# Altium project MCU009A.PrjPcb (part 2 of 4)

## Sheet MCU009A_Power+Misc.SchDoc: Power+Misc
size 431 x 279 mm; Date: Not shown in title block; ApprovedBy: Not shown in title block; CheckedBy: Not shown in title block; Author: Not shown in title block; CompanyName: Not shown in title block; Engineer: Not shown in title block; Organization: Not shown in title block; Address1: Not shown in title block; Address2: Not shown in title block; Address3: Not shown in title block; Address4: Not shown in title block; DocumentNumber: 3; Revision: Use project parameter SCH_Rev; SheetNumber: 3; SheetTotal: 7; PageSetup: Record=PageOptions|CenterHorizontal=True|CenterVertical=True|PrintScale=0.64|XCorrection=1.00|YCorrection=1.00|PrintKind=0|BorderSize=5000000|LeftOffset=0|BottomOffset=0|Orientation=2|PaperLength=1000|PaperWidth=1000|Scale=100|PaperSource=15|PrintQuality=600|MediaType=1|DitherType=10|PrintScaleMode=1|PaperKind=Letter; CurrentTime: Not shown in title block; CurrentDate: Not shown in title block; Time: Not shown in title block; DocumentFullPathAndName: Not shown in title block; DocumentName: Not shown in title block; ModifiedDate: Not shown in title block; ImagePath: Not shown in title block
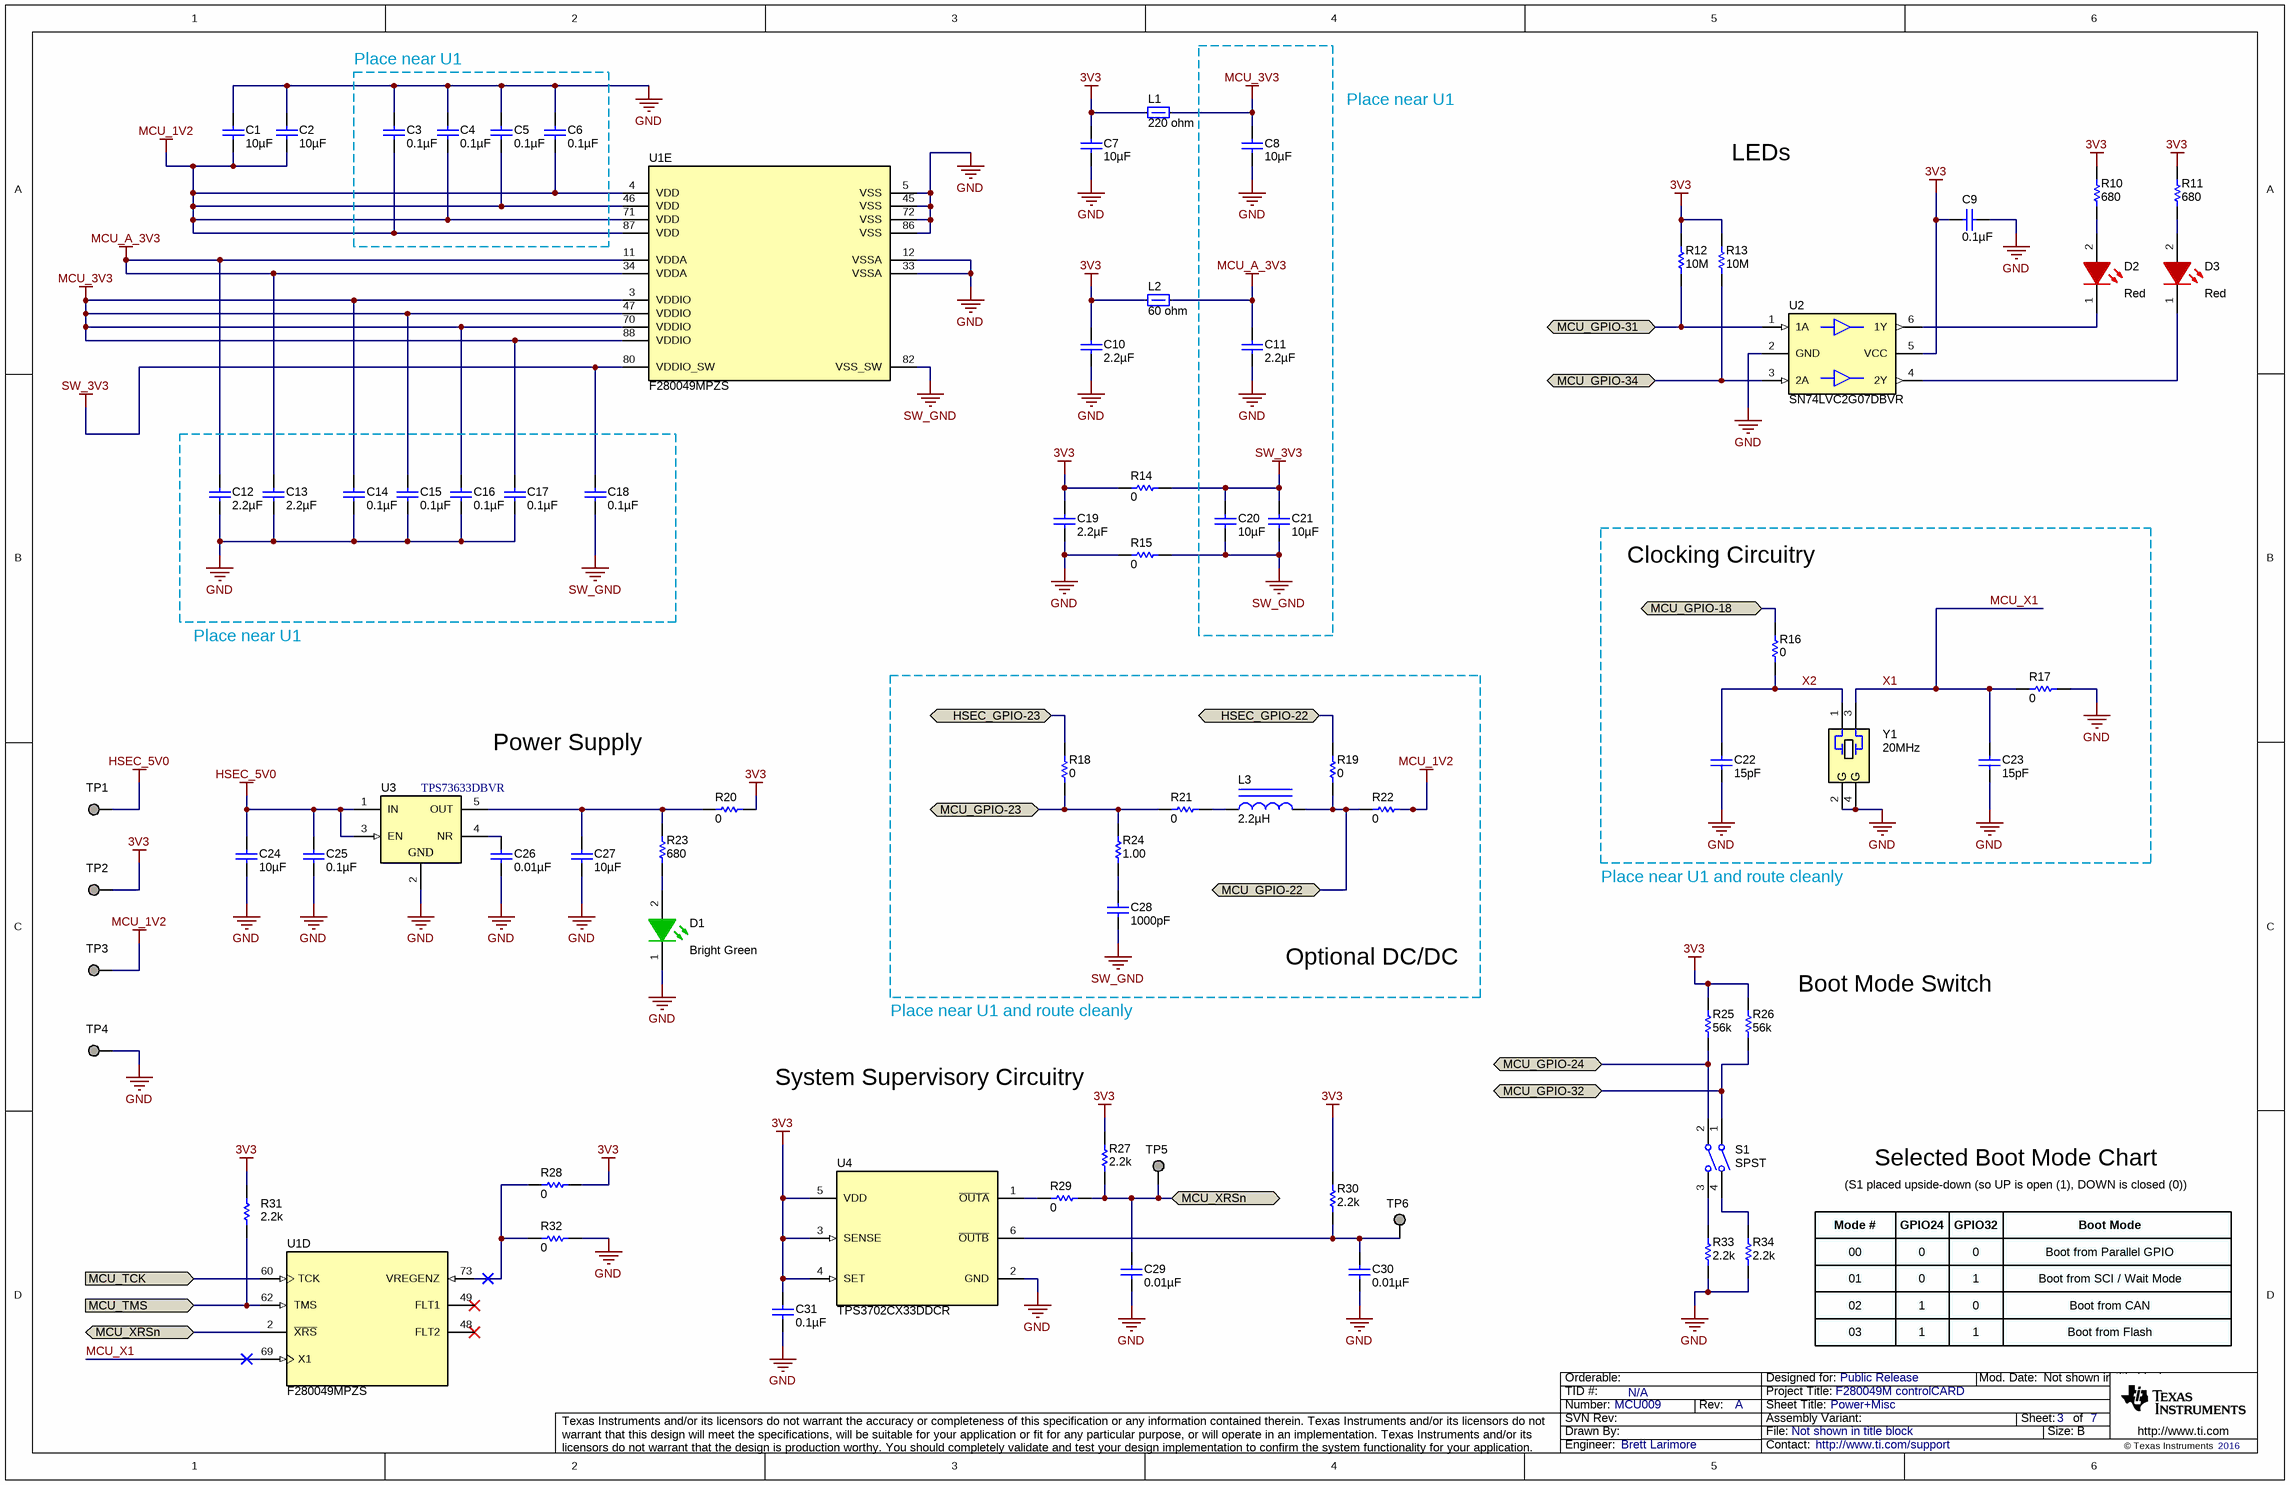
[diagram p2: MCU009A_Power+Misc.SchDoc]

### Parts
C1  ValueDisplayed: 10µF  [0603]  (hidden comment: GRM188R61A106ME69D)
C2  ValueDisplayed: 10µF  [0603]  (hidden comment: GRM188R61A106ME69D)
C3  ValueDisplayed: 0.1µF  [0402]  (hidden comment: GRM155R71A104KA01D)
C4  ValueDisplayed: 0.1µF  [0402]  (hidden comment: GRM155R71A104KA01D)
C5  ValueDisplayed: 0.1µF  [0402]  (hidden comment: GRM155R71A104KA01D)
C6  ValueDisplayed: 0.1µF  [0402]  (hidden comment: GRM155R71A104KA01D)
C7  ValueDisplayed: 10µF  [0805_HV]  (hidden comment: GRM21BR61A106KE19L)
C8  ValueDisplayed: 10µF  [0603]  (hidden comment: GRM188R61A106ME69D)
C9  ValueDisplayed: 0.1µF  [0402]  (hidden comment: GRM155R71A104KA01D)
C10  ValueDisplayed: 2.2µF  [0603]  (hidden comment: GRM188R61A225KE34D)
C11  ValueDisplayed: 2.2µF  [0603]  (hidden comment: GRM188R61A225KE34D)
C12  ValueDisplayed: 2.2µF  [0603]  (hidden comment: GRM188R61A225KE34D)
C13  ValueDisplayed: 2.2µF  [0603]  (hidden comment: GRM188R61A225KE34D)
C14  ValueDisplayed: 0.1µF  [0402]  (hidden comment: GRM155R71A104KA01D)
C15  ValueDisplayed: 0.1µF  [0402]  (hidden comment: GRM155R71A104KA01D)
C16  ValueDisplayed: 0.1µF  [0402]  (hidden comment: GRM155R71A104KA01D)
C17  ValueDisplayed: 0.1µF  [0402]  (hidden comment: GRM155R71A104KA01D)
C18  ValueDisplayed: 0.1µF  [0402]  (hidden comment: GRM155R71A104KA01D)
C19  ValueDisplayed: 2.2µF  [0603]  (hidden comment: GRM188R61A225KE34D)
C20  ValueDisplayed: 10µF  [0603]  (hidden comment: GRM188R61A106ME69D)
C21  ValueDisplayed: 10µF  [0603]  (hidden comment: GRM188R61A106ME69D)
C22  ValueDisplayed: 15pF  [0402]  (hidden comment: GRM1555C1H150JA01D)
C23  ValueDisplayed: 15pF  [0402]  (hidden comment: GRM1555C1H150JA01D)
C24  ValueDisplayed: 10µF  [0603]  (hidden comment: GRM188R61A106ME69D)
C25  ValueDisplayed: 0.1µF  [0402]  (hidden comment: GRM155R71A104KA01D)
C26  ValueDisplayed: 0.01µF  [0402]  (hidden comment: GRM155R71C103KA01D)
C27  ValueDisplayed: 10µF  [0603]  (hidden comment: GRM188R61A106ME69D)
C28  ValueDisplayed: 1000pF  [0402]  (hidden comment: GRM155R71C102KA01D)
C29  ValueDisplayed: 0.01µF  [0402]  (hidden comment: GRM155R71C103KA01D)
C30  ValueDisplayed: 0.01µF  [0402]  (hidden comment: GRM155R71C103KA01D)
C31  ValueDisplayed: 0.1µF  [0402]  (hidden comment: GRM155R71A104KA01D)
D1  value Bright Green  [WL-SMCW_Green_0805]  (hidden comment: 150080VS75000)
D2  value Red  [WL-SMCW_RED_0805]  (hidden comment: 150080SS75000)
D3  value Red  [WL-SMCW_RED_0805]  (hidden comment: 150080SS75000)
L1  value 220 ohm  [0805_HV]  (hidden comment: BLM21PG221SN1D)
L2  value 60 ohm  [0805_HV]  (hidden comment: BKP2125HS600-T)
L3  ValueDisplayed: 2.2µH  [1008]  (hidden comment: LQM2HPN2R2MG0L)
R10  ValueDisplayed: 680  [0402]  (hidden comment: CRCW0402680RJNED)
R11  ValueDisplayed: 680  [0402]  (hidden comment: CRCW0402680RJNED)
R12  ValueDisplayed: 10M  [0402]  (hidden comment: CRCW040210M0JNED)
R13  ValueDisplayed: 10M  [0402]  (hidden comment: CRCW040210M0JNED)
R14  ValueDisplayed: 0  [0805_HV]  (hidden comment: CRCW08050000Z0EA)
R15  ValueDisplayed: 0  [0805_HV]  (hidden comment: CRCW08050000Z0EA)
R16  ValueDisplayed: 0  [0603]  (hidden comment: CRCW06030000Z0EA)
R17  ValueDisplayed: 0  [0603]  (hidden comment: CRCW06030000Z0EA)
R18  ValueDisplayed: 0  [0603]  (hidden comment: CRCW06030000Z0EA)
R19  ValueDisplayed: 0  [0603]  (hidden comment: CRCW06030000Z0EA)
R20  ValueDisplayed: 0  [0805_HV]  (hidden comment: CRCW08050000Z0EA)
R21  ValueDisplayed: 0  [0603]  (hidden comment: CRCW06030000Z0EA)
R22  ValueDisplayed: 0  [0603]  (hidden comment: CRCW06030000Z0EA)
R23  ValueDisplayed: 680  [0402]  (hidden comment: CRCW0402680RJNED)
R24  ValueDisplayed: 1.00  [0402]  (hidden comment: CRCW04021R00FKED)
R25  ValueDisplayed: 56k  [0402]  (hidden comment: CRCW040256K0JNED)
R26  ValueDisplayed: 56k  [0402]  (hidden comment: CRCW040256K0JNED)
R27  ValueDisplayed: 2.2k  [0402]  (hidden comment: CRCW04022K20JNED)
R28  ValueDisplayed: 0  [0603]  (hidden comment: CRCW06030000Z0EA)
R29  ValueDisplayed: 0  [0402]  (hidden comment: CRCW04020000Z0ED)
R30  ValueDisplayed: 2.2k  [0402]  (hidden comment: CRCW04022K20JNED)
R31  ValueDisplayed: 2.2k  [0402]  (hidden comment: CRCW04022K20JNED)
R32  ValueDisplayed: 0  [0603]  (hidden comment: CRCW06030000Z0EA)
R33  ValueDisplayed: 2.2k  [0402]  (hidden comment: CRCW04022K20JNED)
R34  ValueDisplayed: 2.2k  [0402]  (hidden comment: CRCW04022K20JNED)
S1  Circuit: SPST  [SW_218-2LP]  (hidden comment: 218-2LPST)
TP1  TESTPOINT  [TP_50MIL-25MILHOLE]  (value not drawn)  (no BOM)
TP2  TESTPOINT  [TP_50MIL-25MILHOLE]  (value not drawn)  (no BOM)
TP3  TESTPOINT  [TP_50MIL-25MILHOLE]  (value not drawn)  (no BOM)
TP4  TESTPOINT  [TP_50MIL-25MILHOLE]  (value not drawn)  (no BOM)
TP5  TESTPOINT  [TP_50MIL-25MILHOLE]  (value not drawn)  (no BOM)
TP6  TESTPOINT  [TP_50MIL-25MILHOLE]  (value not drawn)  (no BOM)
U1  F280049MPZS  [PZ0100A_N]  (parts D,E of 5)
U2  SN74LVC2G07DBVR  [DBV0006A_N]
U3  TPS73633DBVR  [DBV0005A_N]
U4  TPS3702CX33DDCR  [DDC0006A_N]
Y1  Frequency: 20MHz  [XTAL_TXC-7B]  (hidden comment: 7B-20.000MEEQ-T)

### Ports
HSEC_GPIO-22 (bidir), HSEC_GPIO-23 (bidir), MCU_GPIO-18 (bidir), MCU_GPIO-22 (bidir), MCU_GPIO-23 (bidir), MCU_GPIO-24 (bidir), MCU_GPIO-31 (bidir), MCU_GPIO-32 (bidir), MCU_GPIO-34 (bidir), MCU_TCK (in), MCU_TMS (in), MCU_XRSn (bidir)

### Nets
3V3: C7.2 C9.1 C10.2 C19.2 C31.1 L1.1 L2.1 R10.1 R11.1 R12.2 R13.2 R14.1 R20.2 R25.1 R26.2 R27.2 R28.2 R30.2 R31.2 TP2.1 U2.5(VCC) U4.3(SENSE) U4.4(SET) U4.5(VDD)
GND: C1.2 C2.2 C3.1 C4.1 C5.1 C6.1 C7.1 C8.2 C9.2 C10.1 C11.1 C12.1 C13.1 C14.2 C15.2 C16.2 C17.2 C19.1 C22.2 C23.2 C24.2 C25.2 C26.1 C27.1 C29.1 C30.1 C31.2 D1.1(K) R15.1 R17.1 R32.2 R33.2 R34.1 TP4.1 U1.5(VSS) U1.12(VSSA) U1.33(VSSA) U1.45(VSS) U1.72(VSS) U1.86(VSS) U2.2(GND) U3.2(GND) U4.2(GND) Y1.2(GND) Y1.4(GND)
HSEC_5V0: C24.1 C25.1 TP1.1 U3.1(IN) U3.3(EN)
MCU_1V2: C1.1 C2.1 C3.2 C4.2 C5.2 C6.2 R22.1 TP3.1 U1.4(VDD) U1.46(VDD) U1.71(VDD) U1.87(VDD)
MCU_3V3: C8.1 C14.1 C15.1 C16.1 C17.1 L1.2 U1.3(VDDIO) U1.47(VDDIO) U1.70(VDDIO) U1.88(VDDIO)
MCU_A_3V3: C11.2 C12.2 C13.2 L2.2 U1.11(VDDA) U1.34(VDDA)
SW_3V3: C18.1 C20.2 C21.2 R14.2 U1.80(VDDIO_SW)
SW_GND: C18.2 C20.1 C21.1 C28.2 R15.2 U1.82(VSS_SW)
HSEC_GPIO-22: R19.2 ; port HSEC_GPIO-22
HSEC_GPIO-23: R18.2 ; port HSEC_GPIO-23
MCU_GPIO-18: R16.2 ; port MCU_GPIO-18
MCU_GPIO-22: L3.2 R19.1 R22.2 ; port MCU_GPIO-22
MCU_GPIO-23: R18.1 R21.2 R24.2 ; port MCU_GPIO-23
MCU_GPIO-24: R25.2 S1.2 ; port MCU_GPIO-24
MCU_GPIO-31: R12.1 U2.1(1A) ; port MCU_GPIO-31
MCU_GPIO-32: R26.1 S1.1 ; port MCU_GPIO-32
MCU_GPIO-34: R13.1 U2.3(2A) ; port MCU_GPIO-34
MCU_TCK: U1.60(TCK) ; port MCU_TCK
MCU_TMS: R31.1 U1.62(TMS) ; port MCU_TMS
MCU_X1: C23.1 R17.2 U1.69(X1) Y1.3  [also labelled X1]
MCU_XRSn: C29.2 R27.1 R29.2 TP5.1 U1.2(~{XRS}) ; port MCU_XRSn
X2: C22.1 R16.1 Y1.1
NetC26_2: C26.2 U3.4(NR)
NetC27_2: C27.2 R20.1 R23.1 U3.5(OUT)
NetC28_1: C28.1 R24.1
NetC30_2: C30.2 R30.1 TP6.1 U4.6(~{OUTB})
NetD1_2: D1.2(A) R23.2
NetD2_1: D2.1(K) U2.6(1Y)
NetD2_2: D2.2(A) R10.2
NetD3_1: D3.1(K) U2.4(2Y)
NetD3_2: D3.2(A) R11.2
NetL3_1: L3.1 R21.1
NetR28_1: R28.1 R32.1 U1.73(VREGENZ)
NetR29_1: R29.1 U4.1(~{OUTA})
NetR33_1: R33.1 S1.3
NetR34_2: R34.2 S1.4

Not connected (* = marked no-connect by the designer): U1 48(FLT2)* 49(FLT1)*

### Notes on the sheet
- Place near U1
- LEDs
- Clocking Circuitry
- Power Supply
- Place near U1 and route cleanly
- Optional DC/DC
- (near R26) Boot Mode Switch
- System Supervisory Circuitry
- Selected Boot Mode Chart
- Mode #
- GPIO24
- GPIO32
- (S1 placed upside-down (so UP is open (1), DOWN is closed (0))
- Boot Mode
- 00
- 01
- 02
- 0
- 1
- Boot from Parallel GPIO
- Boot from SCI / Wait Mode
- Boot from CAN
- 03
- Boot from Flash
- Drawn By:
- SVN Rev:
- Number:
- TID #:
- Orderable:
- Rev:
- Sheet Title:
- File:
- Project Title:
- Designed for:
- Assembly Variant:
- Mod. Date:
- Sheet:
- Size:
- of
- B
- http://www.ti.com
- Texas Instruments and/or its licensors do not warrant the accuracy or completeness of this specification or any information contained therein. Texas Instruments and/or its licensors do not warrant that this design will meet the specifications, will be suitable for your application or fit for any particular purpose, or will operate in an implementation. Texas Instruments and/or its licensors do not warrant that the design is production worthy. You should completely validate and test your design implementation to confirm the system functionality for your application.
- Engineer:
- Contact:
- © Texas Instruments
- (in symbol 7B-20.000MEEQ-T) G

### Library data of the parts
C1 C2 C8 C20 C21 C24 C27 = GRM188R61A106ME69D: CAP, CERM, 10 µF, 10 V, +/- 20%, X5R, 0603; Manufacturer: MuRata; Polarized: N; CompType: Capacitor; Value: 10uF; U/M: EA; Cap_F: 0.00001; Tolerance_%: 20; Value1: Unknown; VDC_V: 10; Value2: 10V; TaMin_C: -55; TaMax_C: 85; AEC Category: Q200; SizeArea_mm2: 1.28; SizeAreaWB_mm2: 4.68; SizeX_mm: 1.6; SizeY_mm: 0.8; SizeZ_mm: 1; SymbolVersion: 2008-07-09; PartNumber: GRM188R61A106ME69D; PackageReference: 0603; RoHS: Y; MountType: SMT; Technology: Ceramic; TempCo: X5R; Cap_Case: 0603; Published: 2008-06-19; Publisher: Texas Instruments; LatestRevisionDate: 2016-10-03; ComponentLink1Description: Datasheet link; ComponentLink1URL: http://psearch.murata.com/capacitor/product/GRM188R61A106ME69%23.pdf; AEC Qualified: ?
C3-C6 C14-C18 = GRM155R71A104KA01D: CAP, CERM, 0.1 µF, 10 V, +/- 10%, X7R, 0402; Manufacturer: MuRata; Polarized: N; CompType: Capacitor; Value: 0.1uF; U/M: EA; Cap_F: 0.0000001; Tolerance_%: 10; Value1: Unknown; Value2: 10V; TaMin_C: -55; TaMax_C: 125; SizeArea_mm2: 0.5; SizeAreaWB_mm2: 3; SizeX_mm: 1; SizeZ_mm: 0.6; AEC Category: Q200; SymbolVersion: 2008-07-09; PartNumber: GRM155R71A104KA01D; PackageReference: 0402; RoHS: Y; VDC_V: 10; MountType: SMT; Technology: Ceramic; TempCo: X7R; Cap_Case: 0402; SizeY_mm: 0.5; Published: 2008-06-19; Publisher: Texas Instruments; LatestRevisionDate: 2016-10-03; ComponentLink1Description: Datasheet link; ComponentLink1URL: http://search.murata.co.jp/Ceramy/PnsearchViewAction.do?HnOFG=ON&HnNFG=ON&SEL_CNT=50&sLang=en&sKey=GRM155R71A104KA01D&x=9&y=9&search=startwith; Supplier 1: Digi-Key; Supplier Part Number 1: GRM155R71A104KA01D-ND; Supplier 2: Mouser; Supplier Part Number 2: 81-GRM155R71A104KA1D; Supplier 3: Farnell; Supplier Part Number 3: 1828860; AEC Qualified: ?
C7 = GRM21BR61A106KE19L: CAP, CERM, 10 µF, 10 V, +/- 10%, X5R, 0805; Manufacturer: MuRata; Polarized: N; CompType: Capacitor; Value: 10uF; U/M: EA; Cap_F: 0.00001; Tolerance_%: 10; ESR_ohm: 0.002; Value1: 0.002 ohm; Value2: 10V; TaMin_C: -55; TaMax_C: 85; Cap_Case: 0805; AEC Category: Q200; SizeArea_mm2: 2.5; SizeAreaWB_mm2: 6.75; SizeX_mm: 2; SizeY_mm: 1.25; SizeZ_mm: 1.45; SymbolVersion: 2008-07-09; PartNumber: GRM21BR61A106KE19L; PackageReference: 0805; RoHS: Y; VDC_V: 10; MountType: SMT; Technology: Ceramic; TempCo: X5R; Published: 2008-06-19; Publisher: Texas Instruments; LatestRevisionDate: 2016-10-03; ComponentLink1Description: Datasheet link; ComponentLink1URL: http://search.murata.co.jp/Ceramy/PnsearchViewAction.do?HnOFG=ON&HnNFG=ON&SEL_CNT=50&sLang=en&sKey=GRM21BR61A106KE19L&x=9&y=9&search=startwith; Supplier 1: Digi-Key; Supplier Part Number 1: 490-1709-1-ND; Supplier 2: Mouser; Supplier Part Number 2: 81-GRM21BR61A106KE19; Supplier 3: Farnell; Supplier Part Number 3: 1828805; AEC Qualified: ?
C9 C25 C31 = GRM155R71A104KA01D: CAP, CERM, 0.1 µF, 10 V, +/- 10%, X7R, 0402; Manufacturer: MuRata; Polarized: N; CompType: Capacitor; Value: 0.1uF; U/M: EA; Cap_F: 0.0000001; Tolerance_%: 10; Value1: Unknown; Value2: 10V; TaMin_C: -55; TaMax_C: 125; AEC Category: Q200; SizeArea_mm2: 0.5; SizeAreaWB_mm2: 3; SizeX_mm: 1; SizeZ_mm: 0.6; SymbolVersion: 2008-07-09; PartNumber: GRM155R71A104KA01D; PackageReference: 0402; RoHS: Y; VDC_V: 10; MountType: SMT; Technology: Ceramic; TempCo: X7R; Cap_Case: 0402; Published: 2008-06-19; Publisher: Texas Instruments; LatestRevisionDate: 2016-10-03; ComponentLink1Description: Datasheet link; ComponentLink1URL: http://search.murata.co.jp/Ceramy/PnsearchViewAction.do?HnOFG=ON&HnNFG=ON&SEL_CNT=50&sLang=en&sKey=GRM155R71A104KA01D&x=9&y=9&search=startwith; Supplier 1: Digi-Key; Supplier Part Number 1: GRM155R71A104KA01D-ND; Supplier 2: Mouser; Supplier Part Number 2: 81-GRM155R71A104KA1D; Supplier 3: Farnell; Supplier Part Number 3: 1828860; AEC Qualified: ?; SizeY_mm: 0.5
C10-C13 C19 = GRM188R61A225KE34D: CAP, CERM, 2.2 µF, 10 V, +/- 10%, X5R, 0603; Manufacturer: MuRata; Polarized: N; CompType: Capacitor; Value: 2.2uF; U/M: EA; Cap_F: 0.0000022; Tolerance_%: 10; Value1: Unknown; Value2: 10V; TaMin_C: -55; TaMax_C: 85; AEC Category: Q200; SizeArea_mm2: 1.28; SizeAreaWB_mm2: 4.68; SizeX_mm: 1.6; SizeY_mm: 0.8; SizeZ_mm: 1; SymbolVersion: 2008-07-09; PartNumber: GRM188R61A225KE34D; PackageReference: 0603; RoHS: Y; VDC_V: 10; MountType: SMT; Technology: Ceramic; TempCo: X5R; Cap_Case: 0603; Published: 2008-06-19; Publisher: Texas Instruments; LatestRevisionDate: 2016-10-03; ComponentLink1Description: Datasheet link; ComponentLink1URL: http://search.murata.co.jp/Ceramy/PnsearchViewAction.do?HnOFG=ON&HnNFG=ON&SEL_CNT=50&sLang=en&sKey=GRM188R61A225KE34D&x=9&y=9&search=startwith; Supplier 1: Digi-Key; Supplier Part Number 1: 490-1545-1-ND; Supplier 2: Mouser; Supplier Part Number 2: 81-GRM188R61A225KE34; Supplier 3: Farnell; Supplier Part Number 3: 1828799; AEC Qualified: ?
C22 C23 = GRM1555C1H150JA01D: CAP, CERM, 15 pF, 50 V, +/- 5%, C0G/NP0, 0402; Manufacturer: MuRata; Polarized: N; CompType: Capacitor; Value: 15pF; U/M: EA; Cap_F: 0.000000000015; Tolerance_%: 5; Value1: Unknown; VDC_V: 50; Value2: 50V; TaMin_C: -55; TaMax_C: 125; AEC Category: Q200; SizeArea_mm2: 0.5; SizeAreaWB_mm2: 3; SizeX_mm: 1; SizeZ_mm: 0.6; SymbolVersion: 2008-07-09; PartNumber: GRM1555C1H150JA01D; PackageReference: 0402; RoHS: Y; MountType: SMT; Technology: Ceramic; TempCo: C0G/NP0; Cap_Case: 0402; Published: 2008-06-19; Publisher: Texas Instruments; LatestRevisionDate: 2016-10-03; ComponentLink1Description: Datasheet link; ComponentLink1URL: http://search.murata.co.jp/Ceramy/PnsearchViewAction.do?HnOFG=ON&HnNFG=ON&SEL_CNT=50&sLang=en&sKey=GRM1555C1H150JA01D&x=9&y=9&search=startwith; Supplier 1: Mouser; Supplier Part Number 1: 81-GRM1555C1H150JA1D; AEC Qualified: ?; SizeY_mm: 0.5
C26 C29 C30 = GRM155R71C103KA01D: CAP, CERM, 0.01 µF, 16 V, +/- 10%, X7R, 0402; Manufacturer: MuRata; Polarized: N; CompType: Capacitor; Value: 0.01uF; U/M: EA; Cap_F: 0.00000001; Tolerance_%: 10; Value1: Unknown; VDC_V: 16; Value2: 16V; TaMin_C: -55; TaMax_C: 125; AEC Category: Q200; SizeArea_mm2: 0.5; SizeAreaWB_mm2: 3; SizeX_mm: 1; SizeZ_mm: 0.6; SymbolVersion: 2008-07-09; PartNumber: GRM155R71C103KA01D; PackageReference: 0402; RoHS: Y; MountType: SMT; Technology: Ceramic; TempCo: X7R; Cap_Case: 0402; Published: 2008-06-19; Publisher: Texas Instruments; LatestRevisionDate: 2016-10-03; ComponentLink1Description: Datasheet link; ComponentLink1URL: http://search.murata.co.jp/Ceramy/PnsearchViewAction.do?HnOFG=ON&HnNFG=ON&SEL_CNT=50&sLang=en&sKey=GRM155R71C103KA01D&x=9&y=9&search=startwith; Supplier 1: Digi-Key; Supplier Part Number 1: 490-1313-1-ND; Supplier 2: Mouser; Supplier Part Number 2: 81-GRM36X103K16; Supplier 3: Farnell; Supplier Part Number 3: 1828864; AEC Qualified: ?; SizeY_mm: 0.5
C28 = GRM155R71C102KA01D: CAP, CERM, 1000 pF, 16 V, +/- 10%, X7R, 0402; Manufacturer: MuRata; Polarized: N; CompType: Capacitor; Value: 1000pF; U/M: EA; Cap_F: 0.000000001; Tolerance_%: 10; Value1: Unknown; VDC_V: 16; Value2: 16V; TaMin_C: -55; TaMax_C: 125; SizeArea_mm2: 0.5; SizeAreaWB_mm2: 3; SizeX_mm: 1; SizeZ_mm: 0.6; AEC Category: Q200; SymbolVersion: 2008-07-09; PartNumber: GRM155R71C102KA01D; PackageReference: 0402; RoHS: Y; MountType: SMT; Technology: Ceramic; TempCo: X7R; Cap_Case: 0402; SizeY_mm: 0.5; Published: 2008-06-19; Publisher: Texas Instruments; LatestRevisionDate: 2016-10-03; ComponentLink1Description: Datasheet link; ComponentLink1URL: http://search.murata.co.jp/Ceramy/PnsearchViewAction.do?HnOFG=ON&HnNFG=ON&SEL_CNT=50&sLang=en&sKey=GRM155R71C102KA01D&x=9&y=9&search=startwith; Supplier 1: Digi-Key; Supplier Part Number 1: GRM155R71C102KA01D-ND; Supplier 2: Mouser; Supplier Part Number 2: 81-GRM155R71C102KA1D; AEC Qualified: ?
D1 = 150080VS75000: LED, Bright Green, SMD; Manufacturer: Wurth Elektronik; SymbolCreator: Altium; Type: AlInGaP; Vf_V: 2; Value2: 2V; Io_A: 0.02; Vr_V: 5; Tjmax_C: 85; Power_TotalModule: 0.072; Value1: 0.072W; Angle: 140; U/M: EA; SymbolVersion: 2015-01-20; PartNumber: 150080VS75000; PackageReference: LED_0805; RoHS: Y; CompType: LED; MountType: SMT; Color: Bright Green; Published: 2008-07-11; Publisher: Texas Instruments; ComponentLink1URL: http://katalog.we-online.de/led/datasheet/150080VS75000.pdf; ComponentLink1Description: Datasheet link; LatestRevisionDate: 2016-09-30; Supplier 1: Digi-Key; Supplier Part Number 1: 732-4986-1-ND; Supplier 2: Mouser; Supplier Part Number 2: 710-150080VS75000; Supplier 3: Farnell; Supplier Part Number 3: 2322081
D2 D3 = 150080SS75000: LED, Red, SMD; Manufacturer: Wurth Elektronik; SymbolCreator: Altium; Type: AlInGaP; Vf_V: 1.9; Value2: 1.9V; Io_A: 0.03; Vr_V: 5; Ir_A: 2.5e-005; Tjmax_C: 85; Power_TotalModule: 0.072; Value1: 0.072W; Angle: 140; U/M: EA; SymbolVersion: 2014-12-15; PartNumber: 150080SS75000; PackageReference: LED_0805; RoHS: Y; CompType: LED; MountType: SMT; Color: Red; Published: 2008-07-11; Publisher: Texas Instruments; ComponentLink1URL: http://katalog.we-online.de/led/datasheet/150080SS75000.pdf; ComponentLink1Description: Datasheet link; LatestRevisionDate: 2016-09-30; Supplier 1: Digi-Key; Supplier Part Number 1: 732-4985-1-ND; Supplier 2: Mouser; Supplier Part Number 2: 710-150080SS75000; Supplier 3: Farnell; Supplier Part Number 3: 2322078
L1 = BLM21PG221SN1D: Ferrite Bead, 220 ohm @ 100 MHz, 2 A, 0805; Manufacturer: MuRata; Imax_A: 2; DCR_ohm: 0.045; Value1: 0.045 ohm; Value2: 2A; ZTyp@100MHz_Ohm: 220; CompType: Ferrite Bead; SymbolVersion: 2009-06-02; PartNumber: BLM21PG221SN1D; MountType: SMT; PackageReference: 0805; Published: 2014-04-30; Publisher: Texas Instruments; LatestRevisionDate: 2016-10-02; ComponentLink1Description: Datasheet link; ComponentLink1URL: http://search.murata.co.jp/Ceramy/image/img/PDF/ENG/L0110S0100BLM21P.pdf; RoHS: Y; Supplier 1: Digi-Key; Supplier Part Number 1: 490-1054-1-ND; Supplier 2: Mouser; Supplier Part Number 2: 81-BLM21P221SG; Supplier 3: Farnell; Supplier Part Number 3: 1515661
L2 = BKP2125HS600-T: Ferrite Bead, 60 ohm @ 100 MHz, 3 A, 0805; Manufacturer: Taiyo Yuden; Imax_A: 3; DCR_ohm: 0.025; Value1: 0.025 ohm; Value2: 3A; ZTyp@100MHz_Ohm: 60; CompType: Ferrite Bead; SymbolVersion: 2009-06-02; PartNumber: BKP2125HS600-T; MountType: SMT; PackageReference: 0805; Published: 2014-04-30; Publisher: Texas Instruments; LatestRevisionDate: 2016-10-02; ComponentLink1Description: Datasheet link; ComponentLink1URL: http://www.yuden.co.jp/productdata/catalog/en/mlci08_e.pdf; RoHS: Y; Supplier 1: Digi-Key; Supplier Part Number 1: 587-1932-1-ND; Supplier 2: Mouser; Supplier Part Number 2: 963-BKP2125HS600-T; Supplier 3: Farnell; Supplier Part Number 3: 1463464
L3 = LQM2HPN2R2MG0L: Inductor, Multilayer, Ferrite, 2.2 µH, 1.3 A, 0.08 ohm, SMD; Manufacturer: MuRata; Value: 2.2uH; Ind_H: 2.2E-6; Imax_A: 1.3; Irms: 1.3A @ 40C rise; DCR_ohm: 0.08; Value2: 1.3A; AEC Category: Q200; SizeAreaWB_mm2: 10.5; SizeArea_mm2: 5; SizeX_mm: 2.5; SizeY_mm: 2; SizeZ_mm: 1.2; SymbolVersion: 2008-07-23; CompType: Inductor; PartNumber: LQM2HPN2R2MG0L; Value1: 0.08 ohm; Technology: Multilayer; MountType: SMT; Material: Ferrite; PackageReference: SMD, Body 2.5x2mm, Height 1.2mm; Published: 2008-06-26; Publisher: Texas Instruments; LatestRevisionDate: 2016-09-28; ComponentLink1Description: Datasheet link; ComponentLink1URL: http://psearch.murata.com/inductor/product/LQM2HPN2R2MG0%23.pdf; RoHS: Y; Supplier 1: Digi-Key; Supplier Part Number 1: 490-5114-1-ND; Supplier 2: Mouser; Supplier Part Number 2: 81-LQM2HPN2R2MG0L; AEC Qualified: ?
R10 R11 R23 = CRCW0402680RJNED: RES, 680, 5%, 0.063 W, 0402; Manufacturer: Vishay-Dale; CompType: Resistor; Value: 680; Value_Code: 680R; Tolerance_%: 5; Power_W: 0.063; Value2: 0.063W; VDC_V: 50; TempCo: 200 ppm/C; EIA_Code: E24; U/M: EA; AEC Category: Q200; SizeArea_mm2: 0.5; SizeX_mm: 1; SizeZ_mm: 0.6; SymbolVersion: 2009-05-29; PartNumber: CRCW0402680RJNED; PackageReference: 0402; RoHS: Y; Res_ohm: 680; Value1: 5%; MountType: SMT; Technology: Thick Film; Published: 2008-06-26; Publisher: Texas Instruments; LatestRevisionDate: 2016-10-03; ComponentLink1Description: Datasheet link; ComponentLink1URL: http://www.vishay.com/docs/20035/dcrcwe3.pdf; Supplier 1: Digi-Key; Supplier Part Number 1: 541-680JCT-ND; Supplier 2: Mouser; Supplier Part Number 2: 71-CRCW0402J-680-E3; Supplier 3: Farnell; Supplier Part Number 3: 1537434; AEC Qualified: ?; SizeY_mm: 0.5
R12 R13 = CRCW040210M0JNED: RES, 10 M, 5%, 0.063 W, 0402; Manufacturer: Vishay-Dale; CompType: Resistor; Value: 10Meg; Res_ohm: 10000000; Value_Code: 10M0; Tolerance_%: 5; Power_W: 0.063; Value2: 0.063W; VDC_V: 50; TempCo: 200 ppm/C; SizeArea_mm2: 0.5; SizeX_mm: 1; SizeZ_mm: 0.6; EIA_Code: E24; U/M: EA; AEC Category: Q200; SymbolVersion: 2009-05-29; PartNumber: CRCW040210M0JNED; PackageReference: 0402; RoHS: Y; Value1: 5%; MountType: SMT; Technology: Thick Film; SizeY_mm: 0.5; Published: 2008-06-26; Publisher: Texas Instruments; LatestRevisionDate: 2016-10-03; ComponentLink1Description: Datasheet link; ComponentLink1URL: http://www.vishay.com/docs/20035/dcrcwe3.pdf; Supplier 1: Digi-Key; Supplier Part Number 1: 541-10MJCT-ND; Supplier 2: Mouser; Supplier Part Number 2: 71-CRCW0402J-10M-E3; Supplier 3: Farnell; Supplier Part Number 3: 1514664; AEC Qualified: ?
R14 R15 R20 = CRCW08050000Z0EA: RES, 0, 5%, 0.125 W, 0805; Manufacturer: Vishay-Dale; CompType: Resistor; Value: 0; Value_Code: 0000; Tolerance_%: 5; Power_W: 0.125; Value2: 0.125W; VDC_V: 150; TempCo: 200 ppm/C; EIA_Code: E24; U/M: EA; AEC Category: Q200; SizeArea_mm2: 2.5; SizeX_mm: 2; SizeY_mm: 1.25; SizeZ_mm: 1.45; SymbolVersion: 2009-05-29; PartNumber: CRCW08050000Z0EA; PackageReference: 0805; RoHS: Y; Res_ohm: 0; Value1: 5%; MountType: SMT; Technology: Thick Film; Published: 2008-06-26; Publisher: Texas Instruments; LatestRevisionDate: 2016-09-30; ComponentLink1Description: Datasheet link; ComponentLink1URL: http://www.vishay.com/docs/20035/dcrcwe3.pdf; Supplier 1: Digi-Key; Supplier Part Number 1: 541-0.0ACT-ND; Supplier 2: Mouser; Supplier Part Number 2: 71-CRCW0805-0-E3; Supplier 3: Farnell; Supplier Part Number 3: 1469846; AEC Qualified: ?
R16-R19 R21 R22 R28 R32 = CRCW06030000Z0EA: RES, 0, 5%, 0.1 W, 0603; Manufacturer: Vishay-Dale; CompType: Resistor; Value: 0; Value_Code: 0000; Tolerance_%: 5; Power_W: 0.1; Value2: 0.1W; VDC_V: 75; TempCo: 200 ppm/C; EIA_Code: E24; U/M: EA; AEC Category: Q200; SizeArea_mm2: 1.28; SizeX_mm: 1.6; SizeY_mm: 0.8; SizeZ_mm: 1; SymbolVersion: 2009-05-29; PartNumber: CRCW06030000Z0EA; PackageReference: 0603; RoHS: Y; Res_ohm: 0; Value1: 5%; MountType: SMT; Technology: Thick Film; Published: 2008-06-26; Publisher: Texas Instruments; LatestRevisionDate: 2016-10-03; ComponentLink1Description: Datasheet link; ComponentLink1URL: http://www.vishay.com/docs/20035/dcrcwe3.pdf; Supplier 1: Digi-Key; Supplier Part Number 1: 541-0.0GCT-ND; Supplier 2: Mouser; Supplier Part Number 2: 71-CRCW0603-0-E3; Supplier 3: Farnell; Supplier Part Number 3: 1469739; AEC Qualified: ?
R24 = CRCW04021R00FKED: RES, 1.00, 1%, 0.063 W, 0402; Manufacturer: Vishay-Dale; CompType: Resistor; Value: 1.00; Res_ohm: 1; Value_Code: 1R00; Power_W: 0.063; Value2: 0.063W; VDC_V: 50; TempCo: 100 ppm/C; SizeArea_mm2: 0.5; SizeZ_mm: 0.6; EIA_Code: E96; U/M: EA; AEC Category: Q200; SymbolVersion: 2009-05-29; PartNumber: CRCW04021R00FKED; PackageReference: 0402; RoHS: Y; Tolerance_%: 1; Value1: 1%; MountType: SMT; Technology: Thick Film; SizeX_mm: 1; SizeY_mm: 0.5; Published: 2008-06-26; Publisher: Texas Instruments; LatestRevisionDate: 2016-10-03; ComponentLink1Description: Datasheet link; ComponentLink1URL: http://www.vishay.com/docs/20035/dcrcwe3.pdf; Supplier 1: Digi-Key; Supplier Part Number 1: 541-1.00LLCT-ND; Supplier 2: Mouser; Supplier Part Number 2: 71-CRCW0402-1-E3; Supplier 3: Farnell; Supplier Part Number 3: 1853279; AEC Qualified: ?
R25 R26 = CRCW040256K0JNED: RES, 56 k, 5%, 0.063 W, 0402; Manufacturer: Vishay-Dale; CompType: Resistor; Value: 56k; Res_ohm: 56000; Value_Code: 56k0; Tolerance_%: 5; Power_W: 0.063; Value2: 0.063W; VDC_V: 50; TempCo: 200 ppm/C; EIA_Code: E24; U/M: EA; AEC Category: Q200; SizeArea_mm2: 0.5; SizeX_mm: 1; SizeZ_mm: 0.6; SymbolVersion: 2009-05-29; PartNumber: CRCW040256K0JNED; PackageReference: 0402; RoHS: Y; Value1: 5%; MountType: SMT; Technology: Thick Film; Published: 2008-06-26; Publisher: Texas Instruments; LatestRevisionDate: 2016-10-03; ComponentLink1Description: Datasheet link; ComponentLink1URL: http://www.vishay.com/docs/20035/dcrcwe3.pdf; Supplier 1: Digi-Key; Supplier Part Number 1: 541-56KJCT-ND; Supplier 2: Mouser; Supplier Part Number 2: 71-CRCW0402J-56K-E3; Supplier 3: Farnell; Supplier Part Number 3: 1570683; AEC Qualified: ?; SizeY_mm: 0.5
R27 R30 R31 R33 R34 = CRCW04022K20JNED: RES, 2.2 k, 5%, 0.063 W, 0402; Manufacturer: Vishay-Dale; CompType: Resistor; Value: 2.2k; Res_ohm: 2200; Value_Code: 2k20; Tolerance_%: 5; Power_W: 0.063; Value2: 0.063W; VDC_V: 50; TempCo: 200 ppm/C; EIA_Code: E24; U/M: EA; AEC Category: Q200; SizeArea_mm2: 0.5; SizeX_mm: 1; SizeZ_mm: 0.6; SymbolVersion: 2009-05-29; PartNumber: CRCW04022K20JNED; PackageReference: 0402; RoHS: Y; Value1: 5%; MountType: SMT; Technology: Thick Film; Published: 2008-06-26; Publisher: Texas Instruments; LatestRevisionDate: 2016-10-03; ComponentLink1Description: Datasheet link; ComponentLink1URL: http://www.vishay.com/docs/20035/dcrcwe3.pdf; Supplier 1: Digi-Key; Supplier Part Number 1: 541-2.2KJCT-ND; Supplier 2: Mouser; Supplier Part Number 2: 71-CRCW0402J-2.2K-E3; Supplier 3: Farnell; Supplier Part Number 3: 1514678; AEC Qualified: ?; SizeY_mm: 0.5
R29 = CRCW04020000Z0ED: RES, 0, 5%, 0.063 W, 0402; Manufacturer: Vishay-Dale; CompType: Resistor; Value: 0; Value_Code: 0000; Tolerance_%: 5; Power_W: 0.063; Value2: 0.063W; VDC_V: 50; TempCo: 200 ppm/C; SizeArea_mm2: 0.5; SizeX_mm: 1; SizeZ_mm: 0.6; EIA_Code: E24; U/M: EA; AEC Category: Q200; SymbolVersion: 2009-05-29; PartNumber: CRCW04020000Z0ED; PackageReference: 0402; RoHS: Y; Res_ohm: 0; Value1: 5%; MountType: SMT; Technology: Thick Film; SizeY_mm: 0.5; Published: 2008-06-26; Publisher: Texas Instruments; LatestRevisionDate: 2016-10-03; ComponentLink1Description: Datasheet link; ComponentLink1URL: http://www.vishay.com/docs/20035/dcrcwe3.pdf; Supplier 1: Digi-Key; Supplier Part Number 1: 541-0.0JCT-ND; Supplier 2: Mouser; Supplier Part Number 2: 71-CRCW0402-0-E3; Supplier 3: Farnell; Supplier Part Number 3: 1469661; AEC Qualified: ?
S1 = 218-2LPST: Switch, SPST, 2 Pos, 25mA, 24VDC, SMD; Manufacturer: CTS Electrocomponents; SymbolCreator: Altium; VDC_V: 24; SwitchFunction: Off-On; PositionCount: 2; CurrentRating_mA: 25; SymbolVersion: 2015-05-13; PartNumber: 218-2LPST; MountType: SMT; ComponentLink1Description: Datasheet Link; ComponentLink1URL: http://www.ctscorp.com/components/Datasheets/218.pdf; RoHS: Y; Orientation: Top Actuated; CompType: Switch; PackageReference: 3.71x5.8mm; Publisher: Texas Instruments; LatestRevisionDate: 2016-10-04; Supplier 1: Digi-Key; Supplier Part Number 1: CT2182LPST-ND; Supplier 2: Mouser; Supplier Part Number 2: 774-2182LPST
TP1-TP6 = TESTPOINT: TEST POINT.  No entry in BOM.; SymbolVersion: 2010-10-20; CompType: Testpoint; PackageReference: N/A; Publisher: Texas Instruments; LatestRevisionDate: 2016-08-23; LatestRevisionNote: Added Alternate PartNumber and Alternate Manufacturer parameters to appropriate components.
U1 = F280049MPZS: Piccolo Microcontroller, PZ0100A (LQFP-100); Manufacturer: Texas Instruments; SymbolCreator: Altium; SizeArea_mm2: 256; SizeAreaWB_mm2: 324; SizeX_mm: 16; SizeZ_mm: 1.6; CompType: IC; U/M: EA; SymbolVersion: 2016-08-22; PartNumber: F280049MPZS; PackageReference: PZ0100A; PackageDescription: LQFP-100; MountType: SMT; SizeY_mm: 16; ComponentLink1Description: Datasheet Link; ComponentLink1URL: https://sps06.itg.ti.com/sites/KMS/crossdivteams/altium/docs/ComponentDatasheets/Potenza-DS-June30.pdf; Publisher: Texas Instruments; LatestRevisionDate: 2016-10-04; Alternate Manufacturer: Texas Instruments
U2 = SN74LVC2G07DBVR: DUAL BUFFER/DRIVER WITH OPEN DRAIN OUTPUTS, DBV0006A (SOT-6); Manufacturer: Texas Instruments; SymbolCreator: x0208326; CompType: IC; U/M: EA; SizeArea_mm2: 8.12; SizeAreaWB_mm2: 14.82; SizeX_mm: 2.8; SizeY_mm: 2.9; SizeZ_mm: 1.45; SymbolVersion: 2016-1-26; PartNumber: SN74LVC2G07DBVR; PackageReference: DBV0006A; MountType: SMT; ComponentLink1Description: Datasheet Link; ComponentLink1URL: http://www.ti.com/lit/ds/symlink/sn74lvc2g07.pdf; RoHS: Y; Publisher: Texas Instruments; LatestRevisionDate: 2016-09-28; Alternate Manufacturer: Texas Instruments; PackageDescription: SOT-6
U3 = TPS73633DBVR: Single Output Low Noise LDO, 400 mA, Fixed 3.3 V Output, 1.7 to 5.5 V Input, with Reverse Current Protection, 5-pin SOT-23 (DBV), -40 to 85 degC, Green (RoHS & no Sb/Br); Manufacturer: Texas Instruments; Alternate PartNumber: Equivalent; Accuracy(%): 1; Fixed Output Options(V): 3.3; Iout(Max)(A): 0.4; Iq(Typ)(mA): 0.3; Rating: Catalog; SubFamily: Single Channel LDO; Vdo(Typ)(mV): 75; Vin(Max)(V): 5.5; Vin(Min)(V): 1.7; DatasheetVersion: SBVS038T; PackageVersion: 4073253-4/K; PackageReference: DBV0005A; PackageDescription: 5-Pin Plastic Small Outline, Body 1.60 Ã— 2.90 mm, Pitch 0.95 mm; Supplier 1: Digi-Key; Supplier Part Number 1: 296-27064-2-ND; Supplier 2: Digi-Key; Supplier Part Number 2: 296-27064-1-ND; Supplier 3: Digi-Key; Supplier Part Number 3: 296-27064-6-ND; Supplier 4: Newark; Supplier Part Number 4: 87H2980; Supplier 5: Mouser; Supplier Part Number 5: 595-TPS73633DBVR; Eco-Plan: Green (RoHS & no Sb/Br); Vout Adj(Max)(V): 3.3; Vout Adj(Min)(V): 3.3; MountType: SMT; Code_JEDEC: MO-178; PartNumber: TPS73633DBVR; ComponentLink1Description: Manufacturer URL; ComponentLink1URL: http://www.ti.com/; ComponentLink2Description: Datasheet; ComponentLink2URL: http://www.ti.com/general/docs/lit/getliterature.tsp?genericPartNumber=TPS73633&fileType=pdf; ComponentLink3Description: Package Specification; ComponentLink3URL: http://www.ti.com/litv/pdf/mpds018i; ComponentLink4Description: URL Link1; ComponentLink4URL: Samples URL:http://www.ti.com/product/tps73633#samples; Alternate Manufacturer: Texas Instruments
U4 = TPS3702CX33DDCR: High-Accuracy, Fixed-Threshold OV/UV Monitor, DDC0006A (SOT-6); Alternate PartNumber: TPS3702CX33DDCT; Manufacturer: Texas Instruments; SymbolCreator: Altium; CompType: IC; U/M: EA; SizeArea_mm2: 4.8675; SizeAreaWB_mm2: 10.4675; SizeX_mm: 1.65; SizeY_mm: 2.95; SizeZ_mm: 0.87; SymbolVersion: 2014-08-20; PartNumber: TPS3702CX33DDCR; PackageReference: DDC0006A; MountType: SMT; ComponentLink1Description: Datasheet Link; ComponentLink1URL: http://www.ti.com/lit/ds/symlink/tps3702.pdf; RoHS: Y; Publisher: Texas Instruments; LatestRevisionDate: 2016-09-28; Alternate Manufacturer: Texas Instruments; PackageDescription: SOT-6
Y1 = 7B-20.000MEEQ-T: Crystal, 20.000MHz, 10pF, SMD; Manufacturer: TXC Corporation; SymbolCreator: a0412235; U/M: EA; TaMin_C: -20; TaMax_C: 70; Frequency Stability: ±10ppm; SymbolVersion: 2016-1-26; PartNumber: 7B-20.000MEEQ-T; CompType: Crystal; PackageReference: 5x0.9x3.2mm; MountType: SMT; RoHS: Y; ComponentLink1Description: Datasheet Link; ComponentLink1URL: http://www.txccrystal.com/images/pdf/7b-accuracy.pdf; Publisher: Texas Instruments; LatestRevisionDate: 2016-09-19; Supplier 1: Digi-Key; Supplier Part Number 1: 887-1303-1-ND; Supplier 2: Mouser; Supplier Part Number 2: 717-7B-20.000MEEQ-T; Supplier 3: Farnell; Supplier Part Number 3: 1841989